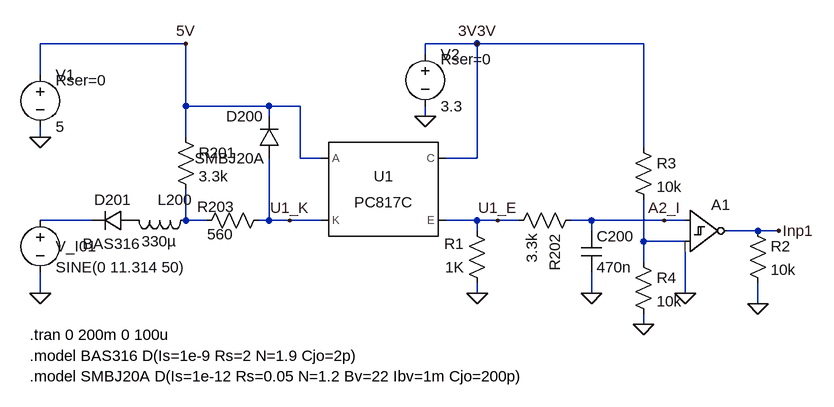
[diagram p0: schematic input_stage_realistic.asc]
input_stage_realistic.asc, the LTspice schematic file:
Version 4.1
SHEET 1 1224 720
WIRE 288 -144 64 -144
WIRE 736 -144 656 -144
WIRE 992 -144 736 -144
WIRE 656 -128 656 -144
WIRE 64 -96 64 -144
WIRE 288 -48 288 -144
WIRE 416 -48 288 -48
WIRE 464 -48 416 -48
WIRE 416 -32 416 -48
WIRE 656 -32 656 -48
WIRE 64 0 64 -16
WIRE 288 0 288 -48
WIRE 992 16 992 -144
WIRE 464 32 464 -48
WIRE 496 32 464 32
WIRE 736 32 736 -144
WIRE 736 32 688 32
WIRE 144 128 64 128
WIRE 288 128 288 80
WIRE 320 128 288 128
WIRE 416 128 416 32
WIRE 416 128 400 128
WIRE 448 128 416 128
WIRE 496 128 448 128
WIRE 736 128 688 128
WIRE 768 128 736 128
WIRE 800 128 768 128
WIRE 912 128 880 128
WIRE 1024 128 912 128
WIRE 1056 128 1024 128
WIRE 736 144 736 128
WIRE 912 144 912 128
WIRE 1168 144 1120 144
WIRE 1200 144 1168 144
WIRE 992 160 992 96
WIRE 1056 160 992 160
WIRE 992 192 992 160
WIRE 64 240 64 208
WIRE 736 240 736 224
WIRE 912 240 912 208
WIRE 1056 240 1056 176
WIRE 1168 256 1168 224
WIRE 992 288 992 272
FLAG 64 240 0
FLAG 912 240 0
FLAG 1200 144 Inp1
FLAG 64 0 0
FLAG 656 -32 0
FLAG 768 128 U1_E
FLAG 1024 128 A2_I
FLAG 448 128 U1_K
FLAG 288 -144 5V
FLAG 736 -144 3V3V
FLAG 736 240 0
FLAG 1168 256 0
FLAG 992 288 0
FLAG 1056 240 0
SYMBOL voltage 64 112 R0
WINDOW 0 24 56 Left 2
WINDOW 3 24 88 Left 2
WINDOW 123 0 0 Left 0
WINDOW 39 0 0 Left 0
SYMATTR InstName V_I01
SYMATTR Value SINE(0 11.314 50)
SYMBOL diode 208 112 R90
WINDOW 0 0 32 VBottom 2
WINDOW 3 36 35 VTop 2
SYMATTR InstName D201
SYMATTR Value BAS316
SYMBOL ind 304 112 R90
WINDOW 0 0 32 VBottom 2
WINDOW 3 32 57 VTop 2
SYMATTR InstName L200
SYMATTR Value 330µ
SYMBOL res 272 -16 R0
SYMATTR InstName R201
SYMATTR Value 3.3k
SYMBOL res 416 112 R90
WINDOW 0 -5 53 VRight 2
WINDOW 3 37 55 VRight 2
SYMATTR InstName R203
SYMATTR Value 560
SYMBOL diode 432 32 R180
WINDOW 0 24 64 Left 2
WINDOW 3 24 0 Left 2
SYMATTR InstName D200
SYMATTR Value SMBJ20A
SYMBOL res 896 112 R90
SYMATTR InstName R202
SYMATTR Value 3.3k
SYMBOL cap 896 144 R0
SYMATTR InstName C200
SYMATTR Value 470n
SYMBOL Optos\\PC817C 592 80 R0
SYMATTR InstName U1
SYMBOL res 752 240 R180
WINDOW 0 36 76 Left 2
WINDOW 3 36 40 Left 2
SYMATTR InstName R1
SYMATTR Value 1K
SYMATTR SpiceLine tol=1 pwr=0.1
SYMBOL voltage 64 -112 R0
WINDOW 123 0 0 Left 0
WINDOW 39 24 24 Left 2
SYMATTR InstName V1
SYMATTR Value 5
SYMATTR SpiceLine Rser=0
SYMBOL voltage 656 -144 R0
WINDOW 123 0 0 Left 0
WINDOW 39 24 24 Left 2
SYMATTR InstName V2
SYMATTR Value 3.3
SYMATTR SpiceLine Rser=0
SYMBOL res 1152 128 R0
SYMATTR InstName R2
SYMATTR Value 10k
SYMBOL Digital\\diffschmtinv 1056 80 R0
SYMATTR InstName A1
SYMBOL res 976 0 R0
SYMATTR InstName R3
SYMATTR Value 10k
SYMBOL res 976 176 R0
SYMATTR InstName R4
SYMATTR Value 10k
TEXT 48 304 Left 2 !.tran 0 200m 0 100u
TEXT 48 336 Left 2 !.model BAS316 D(Is=1e-9 Rs=2 N=1.9 Cjo=2p)
TEXT 48 368 Left 2 !.model SMBJ20A D(Is=1e-12 Rs=0.05 N=1.2 Bv=22 Ibv=1m Cjo=200p)

The netlist it stands for:
* input_stage_realistic.asc
V_I01 N001 0 SINE(0 11.314 50)
D201 P001 N001 BAS316
L200 N002 P001 330µ
R201 5V N002 3.3k
R203 U1_K N002 560
D200 U1_K 5V SMBJ20A
R202 A2_I U1_E 3.3k
C200 A2_I 0 470n
X§U1 5V U1_K 3V3V U1_E PC817 Igain=2.3m  ; PC817C, pins A K C E
R1 0 U1_E 1K tol=1 pwr=0.1
V1 5V 0 5 Rser=0
V2 3V3V 0 3.3 Rser=0
R2 Inp1 0 10k
A1 A2_I N003 0 0 0 Inp1 0 0 SCHMITT
R3 3V3V N003 10k
R4 N003 0 10k
.model D D
.lib standard.dio
.tran 0 200m 0 100u
.model BAS316 D(Is=1e-9 Rs=2 N=1.9 Cjo=2p)
.model SMBJ20A D(Is=1e-12 Rs=0.05 N=1.2 Bv=22 Ibv=1m Cjo=200p)
.lib PC817.sub
.backanno
.end